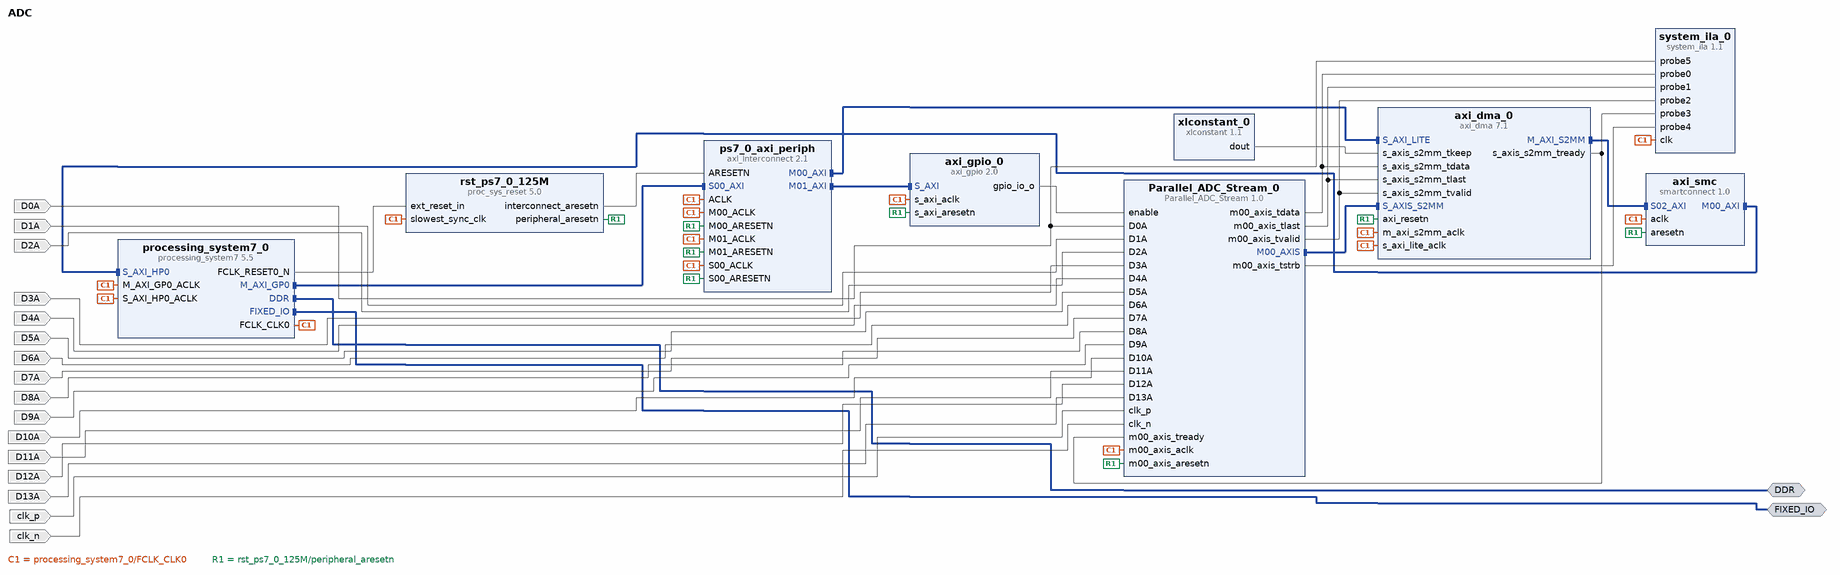
[diagram p0: block diagram of the top level]
# Vivado block design ADC, xc7z010clg400-1, Vivado 2017.4
create_bd_design ADC

create_bd_intf_port -mode Master -vlnv xilinx.com:interface:ddrx_rtl:1.0 DDR
create_bd_intf_port -mode Master -vlnv xilinx.com:display_processing_system7:fixedio_rtl:1.0 FIXED_IO
create_bd_port -dir I D0A
create_bd_port -dir I D1A
create_bd_port -dir I D2A
create_bd_port -dir I D3A
create_bd_port -dir I D4A
create_bd_port -dir I D5A
create_bd_port -dir I D6A
create_bd_port -dir I D7A
create_bd_port -dir I D8A
create_bd_port -dir I D9A
create_bd_port -dir I D10A
create_bd_port -dir I D11A
create_bd_port -dir I D12A
create_bd_port -dir I D13A
create_bd_port -dir I -type clk clk_p
set_property -dict {CONFIG.FREQ_HZ 125000000} [get_bd_ports clk_p]
create_bd_port -dir I -type clk clk_n
set_property -dict {CONFIG.FREQ_HZ 125000000} [get_bd_ports clk_n]

create_bd_cell -type ip -vlnv xilinx.com:ip:axi_dma:7.1 axi_dma_0
set_property -dict {CONFIG.c_include_sg 0 CONFIG.c_include_mm2s 0} [get_bd_cells axi_dma_0]
create_bd_cell -type ip -vlnv xilinx.com:ip:smartconnect:1.0 axi_smc
set_property -dict {CONFIG.NUM_SI 3} [get_bd_cells axi_smc]
create_bd_cell -type ip -vlnv xilinx.com:ip:proc_sys_reset:5.0 rst_ps7_0_125M
create_bd_cell -type ip -vlnv xilinx.com:ip:axi_interconnect:2.1 ps7_0_axi_periph
set_property -dict {CONFIG.NUM_MI 2} [get_bd_cells ps7_0_axi_periph]
create_bd_cell -type ip -vlnv xilinx.com:ip:system_ila:1.1 system_ila_0
set_property -dict {CONFIG.C_DATA_DEPTH 32768 CONFIG.C_NUM_OF_PROBES 6 CONFIG.C_MON_TYPE NATIVE} [get_bd_cells system_ila_0]
create_bd_cell -type ip -vlnv xilinx.com:ip:xlconstant:1.1 xlconstant_0
set_property -dict {CONFIG.CONST_WIDTH 4 CONFIG.CONST_VAL 15} [get_bd_cells xlconstant_0]
create_bd_cell -type ip -vlnv xilinx.com:ip:processing_system7:5.5 processing_system7_0
set_property -dict [list \
  CONFIG.PCW_UART_PERIPHERAL_FREQMHZ 100 \
  CONFIG.PCW_FPGA0_PERIPHERAL_FREQMHZ 125 \
  CONFIG.PCW_USE_S_AXI_HP0 1 \
  CONFIG.PCW_UIPARAM_DDR_BUS_WIDTH {16 Bit} \
  CONFIG.PCW_UIPARAM_DDR_PARTNO {MT41J256M16 RE-125} \
  CONFIG.PCW_QSPI_PERIPHERAL_ENABLE 1 \
  CONFIG.PCW_QSPI_QSPI_IO {MIO 1 .. 6} \
  CONFIG.PCW_QSPI_GRP_SINGLE_SS_ENABLE 1 \
  CONFIG.PCW_QSPI_GRP_SINGLE_SS_IO {MIO 1 .. 6} \
  CONFIG.PCW_SINGLE_QSPI_DATA_MODE x4 \
  CONFIG.PCW_UART0_PERIPHERAL_ENABLE 1 \
  CONFIG.PCW_UART0_UART0_IO {MIO 14 .. 15} \
] [get_bd_cells processing_system7_0]
# 64 more settings of processing_system7_0 are not shown: defaults, MIO pin electricals, DDR timing, and values the tool derives
create_bd_cell -type ip -vlnv xilinx.com:ip:axi_gpio:2.0 axi_gpio_0
set_property -dict {CONFIG.C_GPIO_WIDTH 1 CONFIG.C_ALL_OUTPUTS 1} [get_bd_cells axi_gpio_0]
create_bd_cell -type ip -vlnv xilinx.com:user:Parallel_ADC_Stream:1.0 Parallel_ADC_Stream_0
set_property -dict {CONFIG.NUMBER_OF_OUTPUT_WORDS 1028} [get_bd_cells Parallel_ADC_Stream_0]

# ---- connections ----

connect_bd_intf_net [get_bd_intf_pins ps7_0_axi_periph/M00_AXI] [get_bd_intf_pins axi_dma_0/S_AXI_LITE]
connect_bd_intf_net [get_bd_intf_pins axi_dma_0/M_AXI_S2MM] [get_bd_intf_pins axi_smc/S02_AXI]
connect_bd_intf_net [get_bd_intf_pins Parallel_ADC_Stream_0/M00_AXIS] [get_bd_intf_pins axi_dma_0/S_AXIS_S2MM]
connect_bd_intf_net [get_bd_intf_pins axi_smc/M00_AXI] [get_bd_intf_pins processing_system7_0/S_AXI_HP0]
connect_bd_intf_net [get_bd_intf_pins processing_system7_0/M_AXI_GP0] [get_bd_intf_pins ps7_0_axi_periph/S00_AXI]
connect_bd_intf_net [get_bd_intf_pins ps7_0_axi_periph/M01_AXI] [get_bd_intf_pins axi_gpio_0/S_AXI]
connect_bd_intf_net [get_bd_intf_ports DDR] [get_bd_intf_pins processing_system7_0/DDR]
connect_bd_intf_net [get_bd_intf_ports FIXED_IO] [get_bd_intf_pins processing_system7_0/FIXED_IO]
connect_bd_net [get_bd_pins processing_system7_0/FCLK_CLK0] \
  [get_bd_pins axi_smc/aclk] [get_bd_pins rst_ps7_0_125M/slowest_sync_clk] [get_bd_pins axi_dma_0/s_axi_lite_aclk] \
  [get_bd_pins axi_dma_0/m_axi_s2mm_aclk] [get_bd_pins system_ila_0/clk] [get_bd_pins processing_system7_0/M_AXI_GP0_ACLK] \
  [get_bd_pins processing_system7_0/S_AXI_HP0_ACLK] [get_bd_pins axi_gpio_0/s_axi_aclk] \
  [get_bd_pins ps7_0_axi_periph/S00_ACLK] [get_bd_pins ps7_0_axi_periph/M00_ACLK] [get_bd_pins ps7_0_axi_periph/ACLK] \
  [get_bd_pins ps7_0_axi_periph/M01_ACLK] [get_bd_pins Parallel_ADC_Stream_0/m00_axis_aclk]
connect_bd_net [get_bd_pins rst_ps7_0_125M/peripheral_aresetn] \
  [get_bd_pins axi_smc/aresetn] [get_bd_pins axi_dma_0/axi_resetn] [get_bd_pins axi_gpio_0/s_axi_aresetn] \
  [get_bd_pins ps7_0_axi_periph/S00_ARESETN] [get_bd_pins ps7_0_axi_periph/M00_ARESETN] \
  [get_bd_pins ps7_0_axi_periph/M01_ARESETN] [get_bd_pins Parallel_ADC_Stream_0/m00_axis_aresetn]
connect_bd_net [get_bd_pins rst_ps7_0_125M/interconnect_aresetn] [get_bd_pins ps7_0_axi_periph/ARESETN]
connect_bd_net [get_bd_ports D0A] [get_bd_pins system_ila_0/probe5] [get_bd_pins Parallel_ADC_Stream_0/D0A]
connect_bd_net [get_bd_ports D1A] [get_bd_pins Parallel_ADC_Stream_0/D1A]
connect_bd_net [get_bd_ports D2A] [get_bd_pins Parallel_ADC_Stream_0/D2A]
connect_bd_net [get_bd_ports D3A] [get_bd_pins Parallel_ADC_Stream_0/D3A]
connect_bd_net [get_bd_ports D4A] [get_bd_pins Parallel_ADC_Stream_0/D4A]
connect_bd_net [get_bd_ports D5A] [get_bd_pins Parallel_ADC_Stream_0/D5A]
connect_bd_net [get_bd_ports D6A] [get_bd_pins Parallel_ADC_Stream_0/D6A]
connect_bd_net [get_bd_ports D7A] [get_bd_pins Parallel_ADC_Stream_0/D7A]
connect_bd_net [get_bd_ports D8A] [get_bd_pins Parallel_ADC_Stream_0/D8A]
connect_bd_net [get_bd_ports D9A] [get_bd_pins Parallel_ADC_Stream_0/D9A]
connect_bd_net [get_bd_ports D10A] [get_bd_pins Parallel_ADC_Stream_0/D10A]
connect_bd_net [get_bd_ports D11A] [get_bd_pins Parallel_ADC_Stream_0/D11A]
connect_bd_net [get_bd_ports D12A] [get_bd_pins Parallel_ADC_Stream_0/D12A]
connect_bd_net [get_bd_ports D13A] [get_bd_pins Parallel_ADC_Stream_0/D13A]
connect_bd_net [get_bd_pins Parallel_ADC_Stream_0/m00_axis_tdata] [get_bd_pins system_ila_0/probe0] [get_bd_pins axi_dma_0/s_axis_s2mm_tdata]
connect_bd_net [get_bd_pins Parallel_ADC_Stream_0/m00_axis_tlast] [get_bd_pins system_ila_0/probe1] [get_bd_pins axi_dma_0/s_axis_s2mm_tlast]
connect_bd_net [get_bd_pins Parallel_ADC_Stream_0/m00_axis_tvalid] [get_bd_pins system_ila_0/probe2] [get_bd_pins axi_dma_0/s_axis_s2mm_tvalid]
connect_bd_net [get_bd_pins axi_dma_0/s_axis_s2mm_tready] [get_bd_pins system_ila_0/probe3] [get_bd_pins Parallel_ADC_Stream_0/m00_axis_tready]
connect_bd_net [get_bd_pins xlconstant_0/dout] [get_bd_pins axi_dma_0/s_axis_s2mm_tkeep]
connect_bd_net [get_bd_pins Parallel_ADC_Stream_0/m00_axis_tstrb] [get_bd_pins system_ila_0/probe4]
connect_bd_net [get_bd_pins processing_system7_0/FCLK_RESET0_N] [get_bd_pins rst_ps7_0_125M/ext_reset_in]
connect_bd_net [get_bd_pins axi_gpio_0/gpio_io_o] [get_bd_pins Parallel_ADC_Stream_0/enable]
connect_bd_net [get_bd_ports clk_p] [get_bd_pins Parallel_ADC_Stream_0/clk_p]
connect_bd_net [get_bd_ports clk_n] [get_bd_pins Parallel_ADC_Stream_0/clk_n]

# ---- address map ----
assign_bd_address -offset 0x00000000 -range 512M -target_address_space [get_bd_addr_spaces axi_dma_0/Data_S2MM] [get_bd_addr_segs processing_system7_0/S_AXI_HP0/HP0_DDR_LOWOCM]
assign_bd_address -offset 0x40400000 -range 64K -target_address_space [get_bd_addr_spaces processing_system7_0/Data] [get_bd_addr_segs axi_dma_0/S_AXI_LITE/Reg]
assign_bd_address -offset 0x41200000 -range 64K -target_address_space [get_bd_addr_spaces processing_system7_0/Data] [get_bd_addr_segs axi_gpio_0/S_AXI/Reg]

validate_bd_design
save_bd_design
